# Altium project slave-12-ltc6811-1.PrjPcb (part 2 of 2)

## Sheet secon_analog_in.SchDoc: foxBMS BMS-Slave 12-Cell
size A3; DocumentNumber: 10; SheetNumber: 10; SheetTotal: 19; AUTHOR: Fraunhofer IISB foxBMS Team; SheetDescription: Secondary Analog Inputs
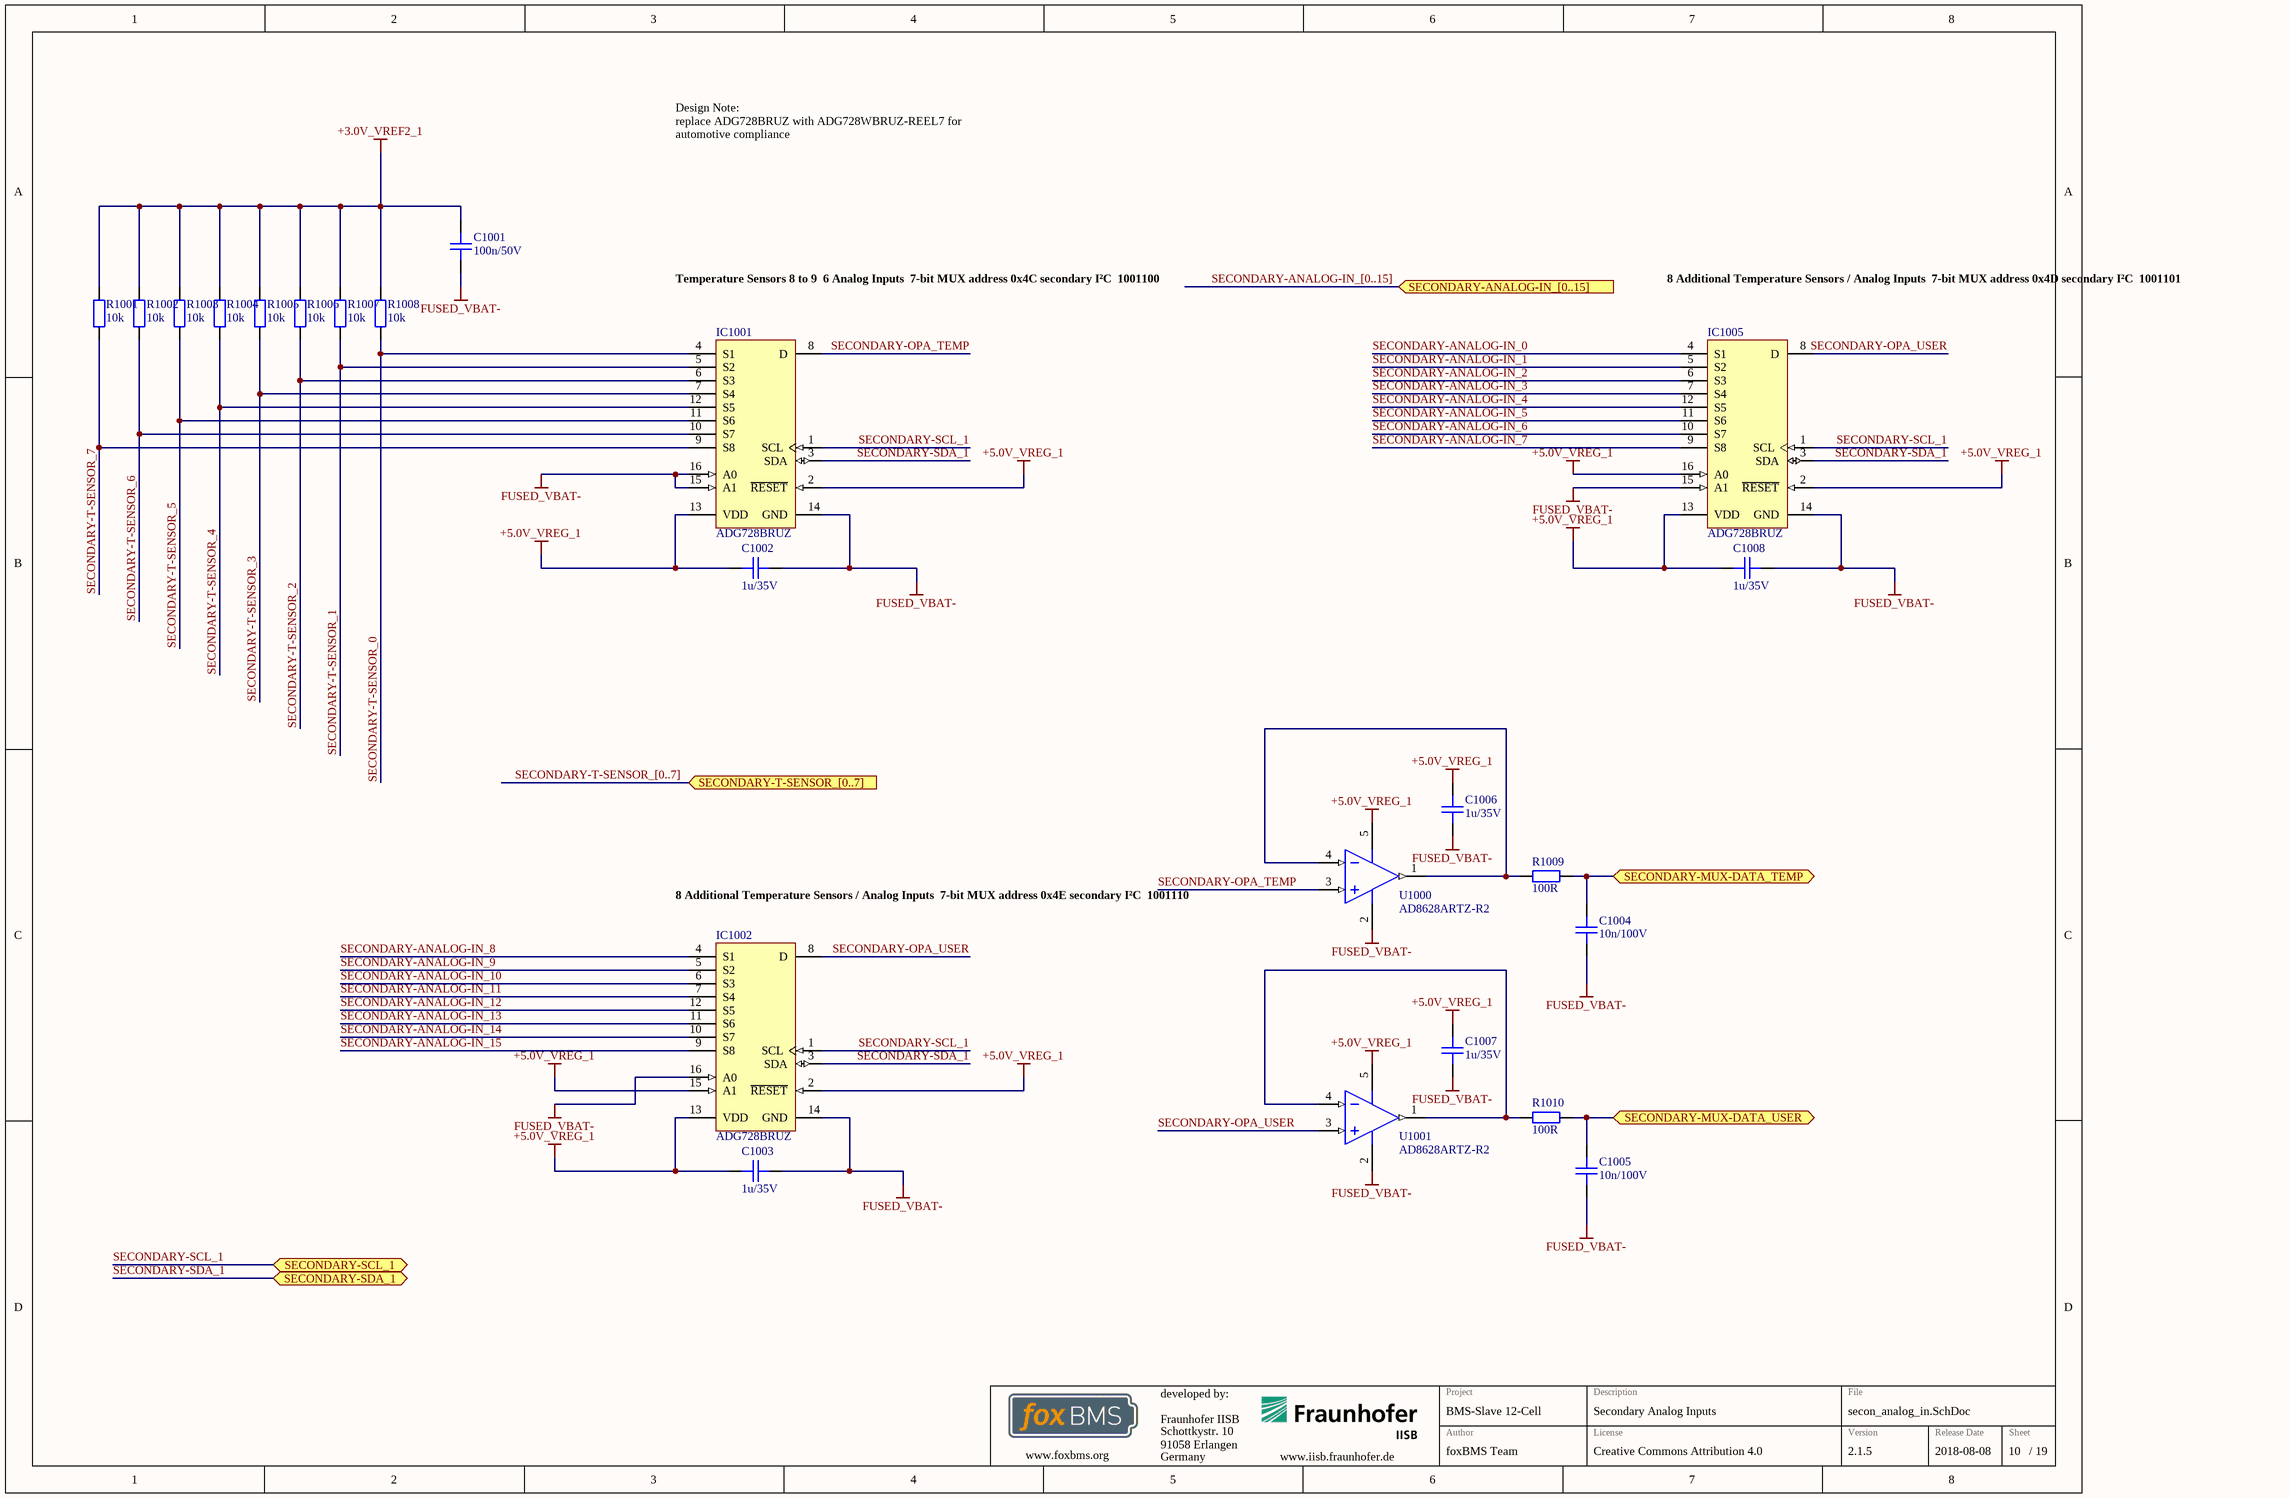
[diagram p6: secon_analog_in.SchDoc]

### Parts
C1001  100n/50V  [CAPC1608X08N]
C1002  1u/35V  [CAPC1608X08N]
C1003  1u/35V  [CAPC1608X08N]
C1004  10n/100V  [CAPC1608X08N]
C1005  10n/100V  [CAPC1608X08N]
C1006  1u/35V  [CAPC1608X08N]
C1007  1u/35V  [CAPC1608X08N]
C1008  1u/35V  [CAPC1608X08N]
IC1001  ADG728BRUZ  [ADI-RU-16_M]
IC1002  ADG728BRUZ  [ADI-RU-16_M]
IC1005  ADG728BRUZ  [ADI-RU-16_M]
R1001  10k  [RESC1608X05N]
R1002  10k  [RESC1608X05N]
R1003  10k  [RESC1608X05N]
R1004  10k  [RESC1608X05N]
R1005  10k  [RESC1608X05N]
R1006  10k  [RESC1608X05N]
R1007  10k  [RESC1608X05N]
R1008  10k  [RESC1608X05N]
R1009  100R  [RESC1608X05N]
R1010  100R  [RESC1608X05N]
U1000  AD8628ARTZ-R2  [ADI-RJ-5_M]
U1001  AD8628ARTZ-R2  [ADI-RJ-5_M]

### Ports
SECONDARY-ANALOG-IN_[0..15] (in), SECONDARY-MUX-DATA_TEMP (bidir), SECONDARY-MUX-DATA_USER (bidir), SECONDARY-SCL_1 (bidir), SECONDARY-SDA_1 (bidir), SECONDARY-T-SENSOR_[0..7] (in)

### Nets
+3.0V_VREF2_1: C1001.2 R1001.2 R1002.2 R1003.2 R1004.2 R1005.2 R1006.2 R1007.2 R1008.2
+5.0V_VREG_1: C1002.2 C1003.2 C1006.2 C1007.2 C1008.2 IC1001.2(~{RESET}) IC1001.13(VDD) IC1002.2(~{RESET}) IC1002.13(VDD) IC1002.15(A1) IC1005.2(~{RESET}) IC1005.13(VDD) IC1005.16(A0) U1000.5(+V) U1001.5(+V)
FUSED_VBAT-: C1001.1 C1002.1 C1003.1 C1004.1 C1005.1 C1006.1 C1007.1 C1008.1 IC1001.14(GND) IC1001.15(A1) IC1001.16(A0) IC1002.14(GND) IC1002.16(A0) IC1005.14(GND) IC1005.15(A1) U1000.2(-V) U1001.2(-V)
SECONDARY-ANALOG-IN_0: IC1005.4(S1)
SECONDARY-ANALOG-IN_1: IC1005.5(S2)
SECONDARY-ANALOG-IN_2: IC1005.6(S3)
SECONDARY-ANALOG-IN_3: IC1005.7(S4)
SECONDARY-ANALOG-IN_4: IC1005.12(S5)
SECONDARY-ANALOG-IN_5: IC1005.11(S6)
SECONDARY-ANALOG-IN_6: IC1005.10(S7)
SECONDARY-ANALOG-IN_7: IC1005.9(S8)
SECONDARY-ANALOG-IN_8: IC1002.4(S1)
SECONDARY-ANALOG-IN_9: IC1002.5(S2)
SECONDARY-ANALOG-IN_10: IC1002.6(S3)
SECONDARY-ANALOG-IN_11: IC1002.7(S4)
SECONDARY-ANALOG-IN_12: IC1002.12(S5)
SECONDARY-ANALOG-IN_13: IC1002.11(S6)
SECONDARY-ANALOG-IN_14: IC1002.10(S7)
SECONDARY-ANALOG-IN_15: IC1002.9(S8)
SECONDARY-OPA_TEMP: IC1001.8(D) U1000.3(+IN)
SECONDARY-OPA_USER: IC1002.8(D) IC1005.8(D) U1001.3(+IN)
SECONDARY-SCL_1: IC1001.1(SCL) IC1002.1(SCL) IC1005.1(SCL) ; port SECONDARY-SCL_1
SECONDARY-SDA_1: IC1001.3(SDA) IC1002.3(SDA) IC1005.3(SDA) ; port SECONDARY-SDA_1
SECONDARY-T-SENSOR_0: IC1001.4(S1) R1008.1
SECONDARY-T-SENSOR_1: IC1001.5(S2) R1007.1
SECONDARY-T-SENSOR_2: IC1001.6(S3) R1006.1
SECONDARY-T-SENSOR_3: IC1001.7(S4) R1005.1
SECONDARY-T-SENSOR_4: IC1001.12(S5) R1004.1
SECONDARY-T-SENSOR_5: IC1001.11(S6) R1003.1
SECONDARY-T-SENSOR_6: IC1001.10(S7) R1002.1
SECONDARY-T-SENSOR_7: IC1001.9(S8) R1001.1
NetC1004_2: C1004.2 R1009.2 ; port SECONDARY-MUX-DATA_TEMP
NetC1005_2: C1005.2 R1010.2 ; port SECONDARY-MUX-DATA_USER
NetR1009_1: R1009.1 U1000.1(OUT) U1000.4(-IN)
NetR1010_1: R1010.1 U1001.1(OUT) U1001.4(-IN)

### Buses and harness runs
bus SECONDARY-ANALOG-IN_[0..15] = port SECONDARY-ANALOG-IN_[0..15]
bus SECONDARY-T-SENSOR_[0..7] = port SECONDARY-T-SENSOR_[0..7]

### Notes on the sheet
- Design Note:
  replace ADG728BRUZ with ADG728WBRUZ-REEL7 for automotive compliance
- Temperature Sensors 8 to 9
  6 Analog Inputs
  7-bit MUX address 0x4C secondary I²C
  1001100
- 8 Additional Temperature Sensors / Analog Inputs
  7-bit MUX address 0x4D secondary I²C
  1001101
- 8 Additional Temperature Sensors / Analog Inputs
  7-bit MUX address 0x4E secondary I²C
  1001110
- Fraunhofer IISB
- Schottkystr. 10
- developed by:
- 91058 Erlangen
- Germany
- Author
- Project
- License
- Description
- File
- Version
- Release Date
- Sheet
- www.foxbms.org
- www.iisb.fraunhofer.de
- foxBMS Team
- /

### Library data of the parts
C1001 = gen_C_ceramic_100n_50V_X7R_0603: MLCC; Capacitance: 100n; Rated Voltage: 50V; Dielectric: X7R; Case EIA: 0603; Case Metric: 1608; PnP Package: C_0603_10; PnP Value: 100n/50V/X7R; PnP equipped: x; Automotive Qualified: False; Part Number: gen_C_ceramic_100n_50V_X7R_0603; Supplier 1: Farnell; Supplier Part Number 1: 2525267; Supplier 2: Digikey; Supplier Part Number 2: 490-6049-1-ND
C1002 C1003 C1006-C1008 = gen_C_ceramic_1u_35V_X7R_0603: MLCC; Capacitance: 1u; Rated Voltage: 35V; Dielectric: X7R; Case EIA: 0603; Case Metric: 1608; PnP Package: C_0603_10; PnP Value: 1uF/35V/X7R; PnP equipped: x; Automotive Qualified: False; Part Number: gen_C_ceramic_1u_35V_X7R_0603; Supplier 1: Farnell; Supplier Part Number 1: 1907508
C1004 C1005 = gen_C_ceramic_10n_100V_X7R_0603: MLCC; Capacitance: 10n; Rated Voltage: 100V; Dielectric: X7R; Case EIA: 0603; Case Metric: 1608; Automotive Qualified: False; Part Number: gen_C_ceramic_10n_100V_X7R_0603; Supplier 1: Farnell; Supplier Part Number 1: 1865545
IC1001 IC1002 IC1005 = CMP-0798-00197-1: CMOS, Low Voltage, 2-Wire Serially Controlled, Matrix Switch, -40 to 85 degC, 16-pin SOP (RU-16), Tube; Manufacturer: Analog Devices; Ron (ohms): 2.5; Supply V Guar Performance: Single_(+3V), Single_(+5V); Max Analog Signal Range: 0 to Vdd; Bandwidth (Hz): 65M; ComponentLink3Description: Package Specification; Packing: Tube; PartNumber: ADG728BRUZ; ComponentLink1URL: http://www.analog.com/en/index.html; Mounting Technology: Surface Mount; DatasheetVersion: Rev. C; ComponentLink1Description: Manufacturer URL; ComponentLink3URL: http:/www.analog.com/static/imported-files/packages/36244347913743854010197452789RU16.pdf; ComponentLink2URL: http://www.analog.com/static/imported-files/data_sheets/ADG728_729.pdf; PackageVersion: Nov-02; PackageDescription: 16-Pin Thin Shrink Small Outline Package, Body 5 x 4.4 mm, Pitch 0.65 mm; Code_JEDEC: MO-153AB; PackageReference: RU-16; ComponentLink2Description: Datasheet
R1001-R1008 = gen_R_10k_0603: SMD Resistor 10k 0603; Tolerance: 1%; Power: 0.1W; Case EIA: 0603; Case Metric: 1608; Maximum Working Voltage: 75V; PnP Package: R_0603; Automotive Qualified: False; Part Number: gen_R_10k_0603; Operating Temperature: -55°C - +155°C; Resistance: 10k; Series: E24, E96; PnP Value: 10k; Supplier 1: Farnell; Supplier Part Number 1: 2073349
R1009 R1010 = gen_R_100R_0603: SMD Resistor 100R 0603; Tolerance: 1%; Power: 0.1W; Case EIA: 0603; Case Metric: 1608; Maximum Working Voltage: 75V; PnP Package: R_0603; Automotive Qualified: False; Part Number: gen_R_100R_0603; Operating Temperature: -55°C - +155°C; Resistance: 100R; Series: E24, E96; PnP Value: 100R; Supplier 1: Farnell; Supplier Part Number 1: 1469752
U1000 U1001 = CMP-0384-01512-2: Single Channel RRIO Operational Amplifier, 2.5 MHz BW, 1 V/us SR, Industrial, 5-pin SOT23 (RJ-5), Reel; Manufacturer: Analog Devices; Generic Part Number: AD8628; Iq/Amp: 1.1mA; Automotive Qualified: Yes; V Span Max: 6V; Input Bias Current: 30pA; Slew Rate: 1V/us; Amplifiers Per Package: 1; Input Offset Voltage: 1uV; Small Signal Bandwidth: 2.5MHz; V Span Min: 2.7V; ComponentLink1Description: Manufacturer URL; DatasheetVersion: Rev. I; ComponentLink4Description: Reference Circuit; Code_JEDEC: MO-178-AA; PackageDescription: 5-Pin Small Outline Transistor Package, Body 2.9 x 1.6 mm, Pitch 0.95 mm; ComponentLink3URL: http://www.analog.com/static/imported-files/packages/PKG_PDF/SOT-23(RJ)/RJ_5.pdf; PackageReference: RJ-5; ComponentLink1URL: http://www.analog.com/en/index.html; PackageVersion: 121608-A; RevisionNote: Reference Circuit URL fixed; Mounting Technology: Surface Mount; ComponentLink2Description: Datasheet; ComponentLink3Description: Package Specification; ComponentLink4URL: http://www.analog.com/en/all-operational-amplifiers-op-amps/operational-amplifiers-op-amps/ad8628/products/product.html#product-recommendations; ComponentLink2URL: http://www.analog.com/static/imported-files/data_sheets/AD8628_8629_8630.pdf; PartNumber: AD8628ARTZ-R2

## Sheet secondary_DIO.SchDoc: foxBMS BMS-Slave 12-Cell
size A3; DocumentNumber: 12; SheetNumber: 12; SheetTotal: 19; AUTHOR: Fraunhofer IISB foxBMS Team; SheetDescription: Secondary Digital Inputs/Outputs
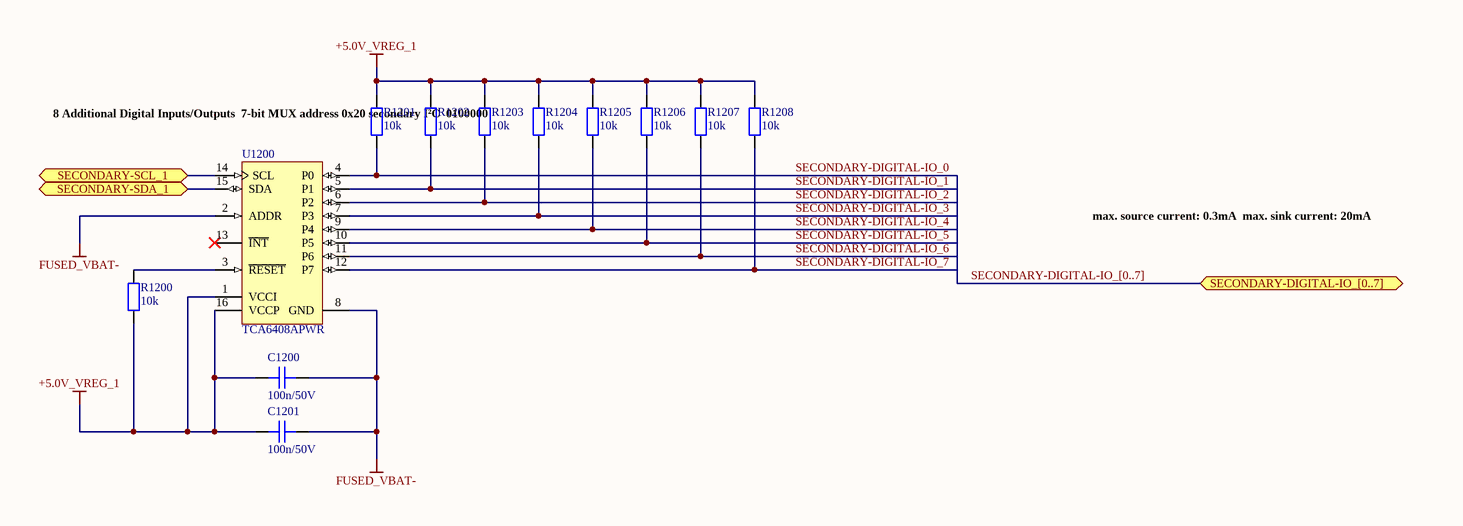
[diagram p7: secondary_DIO.SchDoc]

### Parts
C1200  100n/50V  [CAPC1608X08N]
C1201  100n/50V  [CAPC1608X08N]
R1200  10k  [RESC1608X05N]
R1201  10k  [RESC1608X05N]
R1202  10k  [RESC1608X05N]
R1203  10k  [RESC1608X05N]
R1204  10k  [RESC1608X05N]
R1205  10k  [RESC1608X05N]
R1206  10k  [RESC1608X05N]
R1207  10k  [RESC1608X05N]
R1208  10k  [RESC1608X05N]
U1200  TCA6408APWR  [PW0016A_L]

### Ports
SECONDARY-DIGITAL-IO_[0..7] (bidir), SECONDARY-SCL_1 (bidir), SECONDARY-SDA_1 (bidir)

### Nets
+5.0V_VREG_1: C1200.2 C1201.2 R1200.1 R1201.2 R1202.2 R1203.2 R1204.2 R1205.2 R1206.2 R1207.2 R1208.2 U1200.1(VCCI) U1200.16(VCCP)
FUSED_VBAT-: C1200.1 C1201.1 U1200.2(ADDR) U1200.8(GND)
SECONDARY-DIGITAL-IO_0: R1201.1 U1200.4(P0)
SECONDARY-DIGITAL-IO_1: R1202.1 U1200.5(P1)
SECONDARY-DIGITAL-IO_2: R1203.1 U1200.6(P2)
SECONDARY-DIGITAL-IO_3: R1204.1 U1200.7(P3)
SECONDARY-DIGITAL-IO_4: R1205.1 U1200.9(P4)
SECONDARY-DIGITAL-IO_5: R1206.1 U1200.10(P5)
SECONDARY-DIGITAL-IO_6: R1207.1 U1200.11(P6)
SECONDARY-DIGITAL-IO_7: R1208.1 U1200.12(P7)
NetR1200_2: R1200.2 U1200.3(~{RESET})
NetU1200_14: U1200.14(SCL) ; port SECONDARY-SCL_1
NetU1200_15: U1200.15(SDA) ; port SECONDARY-SDA_1

Not connected (* = marked no-connect by the designer): U1200 13(~{INT})*

### Buses and harness runs
bus SECONDARY-DIGITAL-IO_[0..7] = port SECONDARY-DIGITAL-IO_[0..7]

### Notes on the sheet
- 8 Additional Digital Inputs/Outputs
  7-bit MUX address 0x20 secondary I²C
  0100000
- max. source current: 0.3mA
  max. sink current: 20mA
- Fraunhofer IISB
- Schottkystr. 10
- developed by:
- 91058 Erlangen
- Germany
- Author
- Project
- License
- Description
- File
- Version
- Release Date
- Sheet
- www.foxbms.org
- www.iisb.fraunhofer.de
- foxBMS Team
- /

### Library data of the parts
C1200 C1201 = gen_C_ceramic_100n_50V_X7R_0603: MLCC; Capacitance: 100n; Rated Voltage: 50V; Dielectric: X7R; Case EIA: 0603; Case Metric: 1608; PnP Package: C_0603_10; PnP Value: 100n/50V/X7R; PnP equipped: x; Automotive Qualified: True; Part Number: gen_C_ceramic_100n_50V_X7R_0603; Supplier 1: Farnell; Supplier Part Number 1: 2525267; Supplier 2: Digikey; Supplier Part Number 2: 490-6049-1-ND; Supplier 3: Farnell; Supplier Part Number 3: 2070398
R1200 = gen_R_10k_0603: SMD Resistor 10k 0603; Tolerance: 1%; Power: 0.1W; Case EIA: 0603; Case Metric: 1608; Maximum Working Voltage: 75V; PnP Package: R_0603; Automotive Qualified: True; Part Number: gen_R_10k_0603; Operating Temperature: -55°C - +155°C; Resistance: 10k; Series: E24, E96; PnP Value: 10k; Supplier 1: Farnell; Supplier Part Number 1: 2073349
R1201-R1208 = gen_R_10k_0603: as R1001 on sheet secon_analog_in; Part Number: gen_R_10k_0603; Operating Temperature: -55°C - +155°C; Resistance: 10k; Series: E24, E96; PnP Value: 10k; Supplier 1: Farnell; Supplier Part Number 1: 2073349
U1200 = CMP-0314-00338-2: Low-Voltage 8-Bit I2C and SMBus I/O Expander, 1.65 to 5.5 V, -40 to 85 degC, 16-pin TSSOP (PW), Green (RoHS & no Sb/Br); Manufacturer: Texas Instruments; Push-Pull I/O Type: Yes; Max Frequency(kHz): 400; No. of Outputs: 8; VCC(Min)(V): 1.65; SubFamily: I2C IO Expander; I2C Address: 0100 00x; VCC(Max)(V): 5.5; Vcc range(V): 1.65 to 5.5; PackageDescription: 16-Pin Plastic Thin Small Outline Package 5 x 4.4 mm Body ,0.65 mm Pitch; PartNumber: TCA6408APWR; Configuration Registers: Yes; Eco-Plan: Green (RoHS & no Sb/Br); ComponentLink1Description: Datasheet; Low Power: Yes; ComponentLink1URL: http://www.ti.com/general/docs/lit/getliterature.tsp?genericPartNumber=TCA6408A&fileType=pdf; 5V Tolerant I/O: Yes; Code_JEDEC: MO-153; Interrupt Output: Yes; PackageVersion: revG, Feb-2011; # of I/Os: 8; Reset Input: Yes; fSCLK(Max)(MHz): 400; PackageReference: PW0016A; Mounting Technology: Surface Mount; DatasheetVersion: SCPS192C

## Sheet secondary_EEPROM_and_T.SchDoc: foxBMS BMS-Slave 12-Cell
size A3; DocumentNumber: 14; SheetNumber: 14; SheetTotal: 19; AUTHOR: Fraunhofer IISB foxBMS Team; SheetDescription: Secondary EEPROM and Board T-Sensor
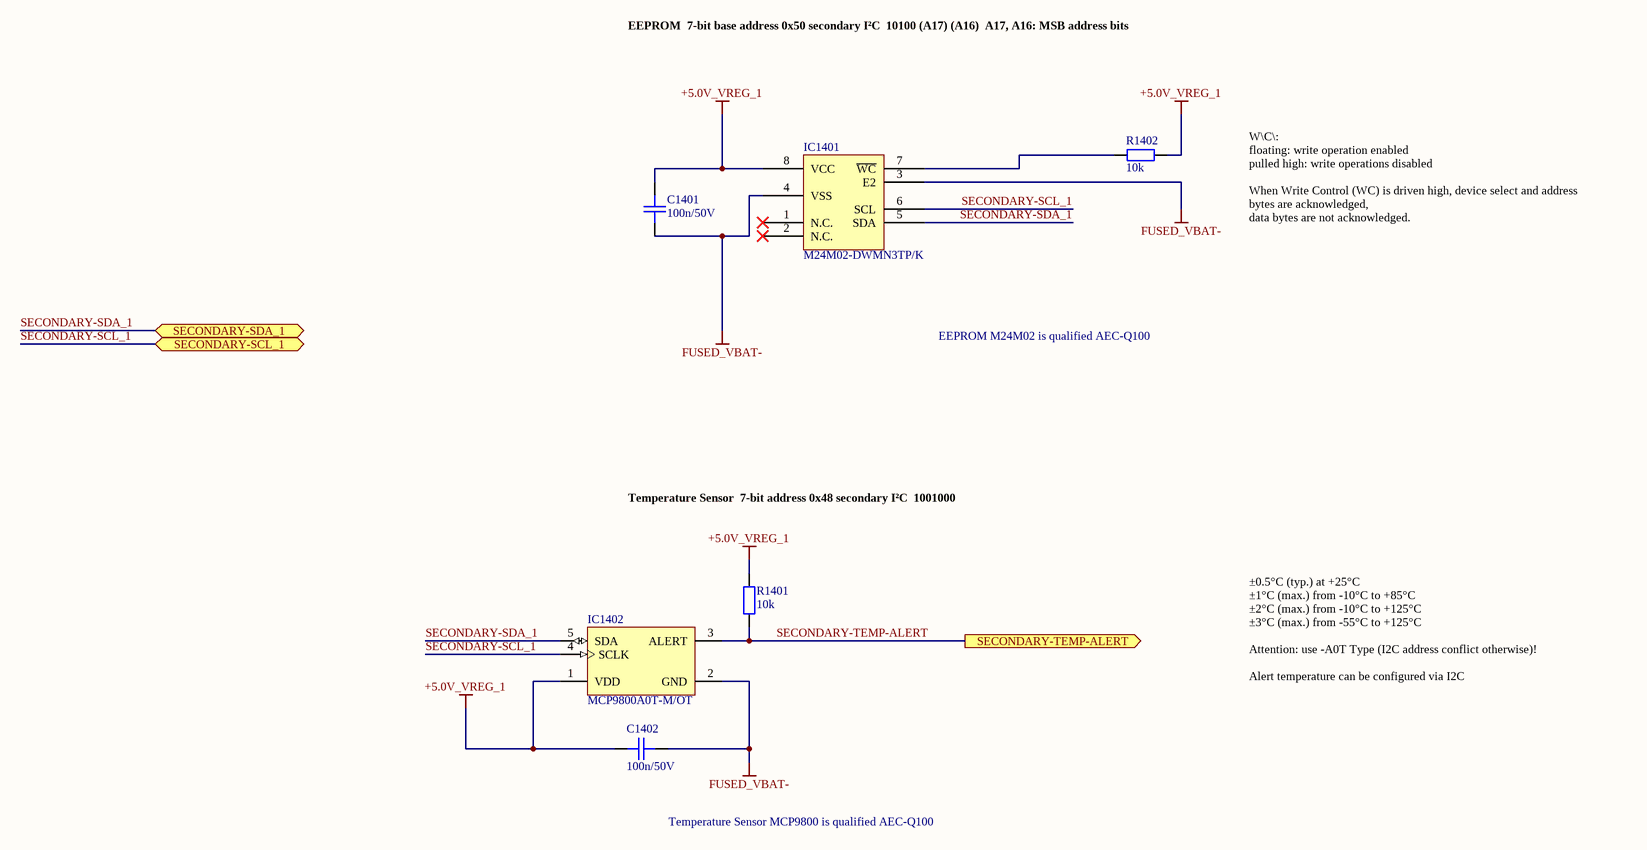
[diagram p8: secondary_EEPROM_and_T.SchDoc]

### Parts
C1401  100n/50V  [CAPC1608X08N]
C1402  100n/50V  [CAPC1608X08N]
IC1401  M24M02-DWMN3TP/K  [SOIC127P600X175-8N]
IC1402  MCP9800A0T-M/OT  [SOT-23-OT5_L]
R1401  10k  [RESC1608X05N]
R1402  10k  [RESC1608X05N]

### Ports
SECONDARY-SCL_1 (bidir), SECONDARY-SDA_1 (bidir), SECONDARY-TEMP-ALERT (out)

### Nets
+5.0V_VREG_1: C1401.2 C1402.2 IC1401.8(VCC) IC1402.1(VDD) R1401.2 R1402.2
FUSED_VBAT-: C1401.1 C1402.1 IC1401.3(E2) IC1401.4(VSS) IC1402.2(GND)
SECONDARY-SCL_1: IC1401.6(SCL) IC1402.4(SCLK) ; port SECONDARY-SCL_1
SECONDARY-SDA_1: IC1401.5(SDA) IC1402.5(SDA) ; port SECONDARY-SDA_1
SECONDARY-TEMP-ALERT: IC1402.3(ALERT) R1401.1 ; port SECONDARY-TEMP-ALERT
NetIC1401_7: IC1401.7(~{WC}) R1402.1

Not connected (* = marked no-connect by the designer): IC1401 1(N.C.)* 2(N.C.)*

### Notes on the sheet
- EEPROM
  7-bit base address 0x50 secondary I²C
  10100 (A17) (A16)
  A17, A16: MSB address bits
- W\C\:
  floating: write operation enabled
  pulled high: write operations disabled
  When Write Control (WC) is driven high, device select and address bytes are acknowledged,
  data bytes are not acknowledged.
- EEPROM M24M02 is qualified AEC-Q100
- Temperature Sensor
  7-bit address 0x48 secondary I²C
  1001000
- ±0.5°C (typ.) at +25°C
  ±1°C (max.) from -10°C to +85°C
  ±2°C (max.) from -10°C to +125°C
  ±3°C (max.) from -55°C to +125°C
  Attention: use -A0T Type (I2C address conflict otherwise)!
  Alert temperature can be configured via I2C
- Temperature Sensor MCP9800 is qualified AEC-Q100
- Fraunhofer IISB
- Schottkystr. 10
- developed by:
- 91058 Erlangen
- Germany
- Author
- Project
- License
- Description
- File
- Version
- Release Date
- Sheet
- www.foxbms.org
- www.iisb.fraunhofer.de
- foxBMS Team
- /

### Library data of the parts
C1401 C1402 = gen_C_ceramic_100n_50V_X7R_0603: as C1001 on sheet secon_analog_in; Part Number: gen_C_ceramic_100n_50V_X7R_0603; Supplier 1: Farnell; Supplier Part Number 1: 2525267; Supplier 2: Digikey; Supplier Part Number 2: 490-6049-1-ND
IC1401 = M24M02-DWMN3TP/K: Automotive 2-Mbit serial I²C / bus EEPROM with 1 MHz clock; Manufacturer: STMicroelectronics; PnP Package: SO8N; Automotive Qualified: True; Part Number: M24M02-DWMN3TP/K; Part Name: M24M02-DWMN3TP/K; Operating Temperature: -40°C - +125°C; ComponentLink1Description: Datasheet; ComponentLink1URL: http://www.st.com/content/ccc/resource/technical/document/datasheet/83/f4/3e/e4/4e/49/42/c5/DM00200595.pdf/files/DM00200595.pdf/jcr:content/translations/en.DM00200595.pdf; Supplier 1: Digikey; Supplier Part Number 1: 497-16238-1-ND; Supplier 2: Mouser; Supplier Part Number 2: 511-M24M02-DWMN3TP/K
IC1402 = CMP-0192-00211-1: 2-Wire High-Accuracy Temperature Sensor, Slave Address 000, 5-Pin SOT-23, -55°C to +125°C Temperature, Tape and Reel; PackageReference: SOT-23-OT5; PackageVersion: revBB, Aug-2009; DatasheetVersion: revD, Nov-2010; PackageDescription: 5-Lead Plastic Small Outline Transistor (OT) [SOT-23]; Code_IPC: SOT23-5
R1401 R1402 = gen_R_10k_0603: as R1001 on sheet secon_analog_in; Part Number: gen_R_10k_0603; Operating Temperature: -55°C - +155°C; Resistance: 10k; Series: E24, E96; PnP Value: 10k; Supplier 1: Farnell; Supplier Part Number 1: 2073349

## Sheet connectors.SchDoc: foxBMS BMS-Slave 12-Cell
size A3; DocumentNumber: 16; SheetNumber: 16; SheetTotal: 19; AUTHOR: Fraunhofer IISB foxBMS Team; SheetDescription: Connectors
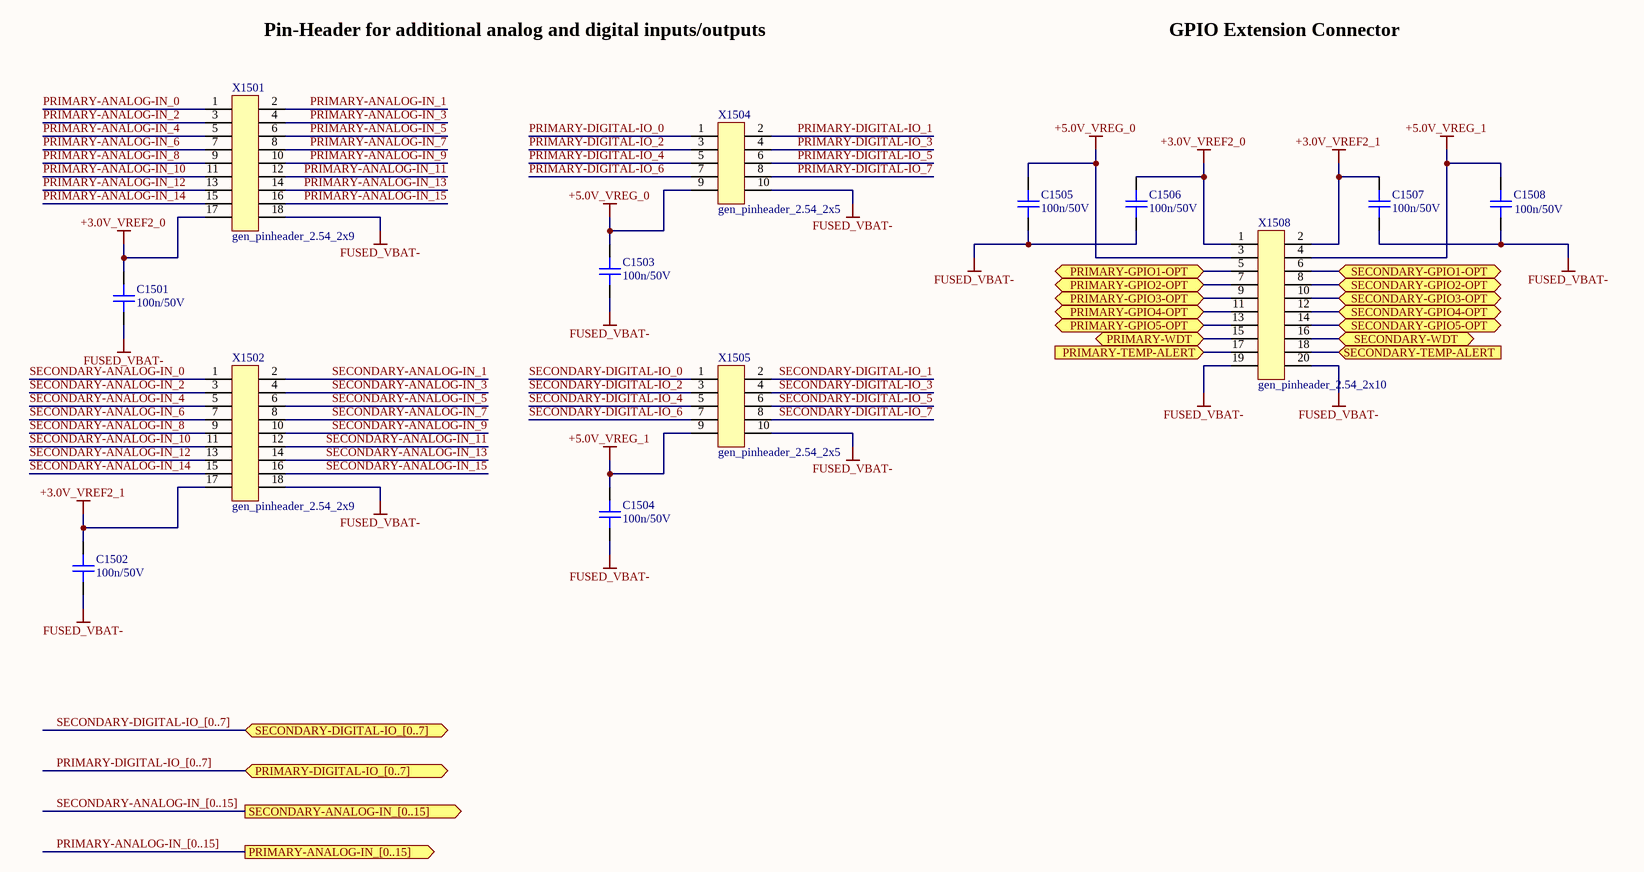
[diagram p9: connectors.SchDoc]

### Parts
C1501  100n/50V  [CAPC1608X08N]
C1502  100n/50V  [CAPC1608X08N]
C1503  100n/50V  [CAPC1608X08N]
C1504  100n/50V  [CAPC1608X08N]
C1505  100n/50V  [CAPC1608X08N]
C1506  100n/50V  [CAPC1608X08N]
C1507  100n/50V  [CAPC1608X08N]
C1508  100n/50V  [CAPC1608X08N]
X1501  gen_pinheader_2.54_2x9  [Pinheader_2.54_2x9]
X1502  gen_pinheader_2.54_2x9  [Pinheader_2.54_2x9]
X1504  gen_pinheader_2.54_2x5  [Pinheader_2.54_2x5]
X1505  gen_pinheader_2.54_2x5  [Pinheader_2.54_2x5]
X1508  gen_pinheader_2.54_2x10  [Pinheader_2.54_2x10]

### Ports
PRIMARY-ANALOG-IN_[0..15] (out), PRIMARY-DIGITAL-IO_[0..7] (bidir), PRIMARY-GPIO1-OPT (bidir), PRIMARY-GPIO2-OPT (bidir), PRIMARY-GPIO3-OPT (bidir), PRIMARY-GPIO4-OPT (bidir), PRIMARY-GPIO5-OPT (bidir), PRIMARY-TEMP-ALERT (in), PRIMARY-WDT (bidir), SECONDARY-ANALOG-IN_[0..15] (out), SECONDARY-DIGITAL-IO_[0..7] (bidir), SECONDARY-GPIO1-OPT (bidir), SECONDARY-GPIO2-OPT (bidir), SECONDARY-GPIO3-OPT (bidir), SECONDARY-GPIO4-OPT (bidir), SECONDARY-GPIO5-OPT (bidir), SECONDARY-TEMP-ALERT (in), SECONDARY-WDT (bidir)

### Nets
+3.0V_VREF2_0: C1501.2 C1506.2 X1501.17 X1508.1
+3.0V_VREF2_1: C1502.2 C1507.2 X1502.17 X1508.2
+5.0V_VREG_0: C1503.2 C1505.2 X1504.9 X1508.3
+5.0V_VREG_1: C1504.2 C1508.2 X1505.9 X1508.4
FUSED_VBAT-: C1501.1 C1502.1 C1503.1 C1504.1 C1505.1 C1506.1 C1507.1 C1508.1 X1501.18 X1502.18 X1504.10 X1505.10 X1508.19 X1508.20
PRIMARY-ANALOG-IN_0: X1501.1
PRIMARY-ANALOG-IN_1: X1501.2
PRIMARY-ANALOG-IN_2: X1501.3
PRIMARY-ANALOG-IN_3: X1501.4
PRIMARY-ANALOG-IN_4: X1501.5
PRIMARY-ANALOG-IN_5: X1501.6
PRIMARY-ANALOG-IN_6: X1501.7
PRIMARY-ANALOG-IN_7: X1501.8
PRIMARY-ANALOG-IN_8: X1501.9
PRIMARY-ANALOG-IN_9: X1501.10
PRIMARY-ANALOG-IN_10: X1501.11
PRIMARY-ANALOG-IN_11: X1501.12
PRIMARY-ANALOG-IN_12: X1501.13
PRIMARY-ANALOG-IN_13: X1501.14
PRIMARY-ANALOG-IN_14: X1501.15
PRIMARY-ANALOG-IN_15: X1501.16
PRIMARY-DIGITAL-IO_0: X1504.1
PRIMARY-DIGITAL-IO_1: X1504.2
PRIMARY-DIGITAL-IO_2: X1504.3
PRIMARY-DIGITAL-IO_3: X1504.4
PRIMARY-DIGITAL-IO_4: X1504.5
PRIMARY-DIGITAL-IO_5: X1504.6
PRIMARY-DIGITAL-IO_6: X1504.7
PRIMARY-DIGITAL-IO_7: X1504.8
SECONDARY-ANALOG-IN_0: X1502.1
SECONDARY-ANALOG-IN_1: X1502.2
SECONDARY-ANALOG-IN_2: X1502.3
SECONDARY-ANALOG-IN_3: X1502.4
SECONDARY-ANALOG-IN_4: X1502.5
SECONDARY-ANALOG-IN_5: X1502.6
SECONDARY-ANALOG-IN_6: X1502.7
SECONDARY-ANALOG-IN_7: X1502.8
SECONDARY-ANALOG-IN_8: X1502.9
SECONDARY-ANALOG-IN_9: X1502.10
SECONDARY-ANALOG-IN_10: X1502.11
SECONDARY-ANALOG-IN_11: X1502.12
SECONDARY-ANALOG-IN_12: X1502.13
SECONDARY-ANALOG-IN_13: X1502.14
SECONDARY-ANALOG-IN_14: X1502.15
SECONDARY-ANALOG-IN_15: X1502.16
SECONDARY-DIGITAL-IO_0: X1505.1
SECONDARY-DIGITAL-IO_1: X1505.2
SECONDARY-DIGITAL-IO_2: X1505.3
SECONDARY-DIGITAL-IO_3: X1505.4
SECONDARY-DIGITAL-IO_4: X1505.5
SECONDARY-DIGITAL-IO_5: X1505.6
SECONDARY-DIGITAL-IO_6: X1505.7
SECONDARY-DIGITAL-IO_7: X1505.8
NetX1508_5: X1508.5 ; port PRIMARY-GPIO1-OPT
NetX1508_6: X1508.6 ; port SECONDARY-GPIO1-OPT
NetX1508_7: X1508.7 ; port PRIMARY-GPIO2-OPT
NetX1508_8: X1508.8 ; port SECONDARY-GPIO2-OPT
NetX1508_9: X1508.9 ; port PRIMARY-GPIO3-OPT
NetX1508_10: X1508.10 ; port SECONDARY-GPIO3-OPT
NetX1508_11: X1508.11 ; port PRIMARY-GPIO4-OPT
NetX1508_12: X1508.12 ; port SECONDARY-GPIO4-OPT
NetX1508_13: X1508.13 ; port PRIMARY-GPIO5-OPT
NetX1508_14: X1508.14 ; port SECONDARY-GPIO5-OPT
NetX1508_15: X1508.15 ; port PRIMARY-WDT
NetX1508_16: X1508.16 ; port SECONDARY-WDT
NetX1508_17: X1508.17 ; port PRIMARY-TEMP-ALERT
NetX1508_18: X1508.18 ; port SECONDARY-TEMP-ALERT

### Buses and harness runs
bus PRIMARY-ANALOG-IN_[0..15] = port PRIMARY-ANALOG-IN_[0..15]
bus PRIMARY-DIGITAL-IO_[0..7] = port PRIMARY-DIGITAL-IO_[0..7]
bus SECONDARY-ANALOG-IN_[0..15] = port SECONDARY-ANALOG-IN_[0..15]
bus SECONDARY-DIGITAL-IO_[0..7] = port SECONDARY-DIGITAL-IO_[0..7]

### Notes on the sheet
- Pin-Header for additional analog and digital inputs/outputs
- GPIO Extension Connector
- Fraunhofer IISB
- Schottkystr. 10
- developed by:
- 91058 Erlangen
- Germany
- Author
- Project
- License
- Description
- File
- Version
- Release Date
- Sheet
- www.foxbms.org
- www.iisb.fraunhofer.de
- foxBMS Team
- /

### Library data of the parts
C1501-C1508 = gen_C_ceramic_100n_50V_X7R_0603: MLCC; Capacitance: 100n; Rated Voltage: 50V; Dielectric: X7R; Case EIA: 0603; Case Metric: 1608; PnP Package: C_0603_10; PnP Value: 100n/50V/X7R; PnP equipped: x; Automotive Qualified: False; Part Number: gen_C_ceramic_100n_50V_X7R_0603; Supplier 1: Farnell; Supplier Part Number 1: 2525267; Supplier 2: Digikey; Supplier Part Number 2: 490-6049-1-ND
X1501 X1502 = gen_pinheader_2.54_2x9: Standard Pinheader, THD, gerade, 2.54mm, 2-reihig; Circuits: 18; Rated Voltage: 250V; Rated Current: 3A; Automotive Qualified: False; Part Number: gen_pinheader_2.54_2x9; Part Name: PinHeader; Operating Temperature: −40 °C - +105 °C; Supplier 1: Farnell; Supplier Part Number 1: 2025256
X1504 X1505 = gen_pinheader_2.54_2x5: Standard Pinheader, THD, gerade, 2.54mm, 2-reihig; Circuits: 10; Rated Voltage: 250V; Rated Current: 3A; Automotive Qualified: False; Part Number: gen_pinheader_2.54_2x5; Part Name: PinHeader; Operating Temperature: −40 °C - +105 °C; Supplier 1: Farnell; Supplier Part Number 1: 2578720
X1508 = gen_pinheader_2.54_2x10: Standard Pinheader, THD, gerade, 2.54mm, 2-reihig; Circuits: 20; Rated Voltage: 250V; Rated Current: 3A; Automotive Qualified: False; Part Number: gen_pinheader_2.54_2x10; Part Name: PinHeader; Operating Temperature: −40 °C - +105 °C; Supplier 1: Farnell; Supplier Part Number 1: 2025257

## Sheet daisy_chain_connectors.SchDoc
size A3; DocumentNumber: 15; SheetNumber: 15; SheetTotal: 19; SheetDescription: Daisy Chain Connectors
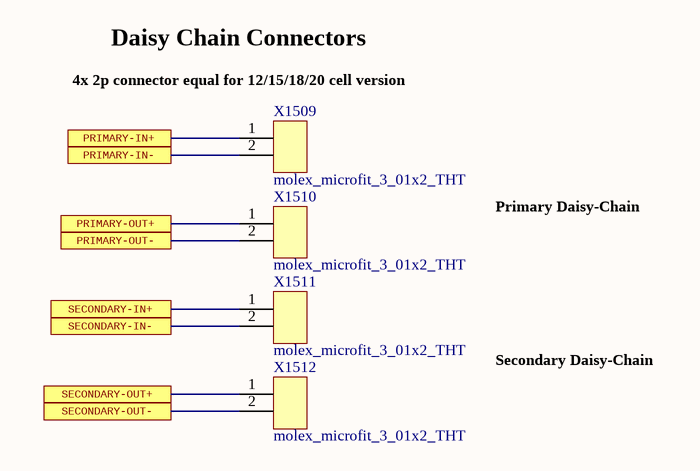
[diagram p10: daisy_chain_connectors.SchDoc]

### Parts
X1509  molex_microfit_3_01x2_THT  [MOLEX_MICROFIT_01x2_THT]
X1510  molex_microfit_3_01x2_THT  [MOLEX_MICROFIT_01x2_THT]
X1511  molex_microfit_3_01x2_THT  [MOLEX_MICROFIT_01x2_THT]
X1512  molex_microfit_3_01x2_THT  [MOLEX_MICROFIT_01x2_THT]

### Ports
PRIMARY-IN+, PRIMARY-IN-, PRIMARY-OUT+, PRIMARY-OUT-, SECONDARY-IN+, SECONDARY-IN-, SECONDARY-OUT+, SECONDARY-OUT-

### Nets
NetX1509_1: X1509.1 ; port PRIMARY-IN+
NetX1509_2: X1509.2 ; port PRIMARY-IN-
NetX1510_1: X1510.1 ; port PRIMARY-OUT+
NetX1510_2: X1510.2 ; port PRIMARY-OUT-
NetX1511_1: X1511.1 ; port SECONDARY-IN+
NetX1511_2: X1511.2 ; port SECONDARY-IN-
NetX1512_1: X1512.1 ; port SECONDARY-OUT+
NetX1512_2: X1512.2 ; port SECONDARY-OUT-

### Notes on the sheet
- Daisy Chain Connectors
- (near X1509) 4x 2p connector equal for 12/15/18/20 cell version
- Primary Daisy-Chain
- Secondary Daisy-Chain
- Fraunhofer IISB
- Schottkystr. 10
- developed by:
- 91058 Erlangen
- Germany
- Author
- Project
- License
- Description
- File
- Version
- Release Date
- Sheet
- www.foxbms.org
- www.iisb.fraunhofer.de
- foxBMS Team
- /

### Library data of the parts
X1509-X1512 = molex_microfit_3_01x2_THT: Micro-Fit 3.0 Right Angle Header, 3.00mm Pitch, Dual Row, 2 Circuits, with Snap-in Plastic Peg PCB Lock, Tin, Glow Wire Capable, Black, 43045-0200; Manufacturer: Molex; Circuits: 2; Rated Voltage: 600V; Rated Current: 8.5A; Automotive Qualified: False; Part Number: molex_microfit_3_01x2_THT; Part Name: MicroFit; Operating Temperature: -40°C - +105°C; Supplier 1: Farnell; Supplier Part Number 1: 1012251

## Sheet ext_supply_con.SchDoc
size A3; DocumentNumber: 19; SheetNumber: 19; SheetTotal: 19; SheetDescription: External Power Supply Connector
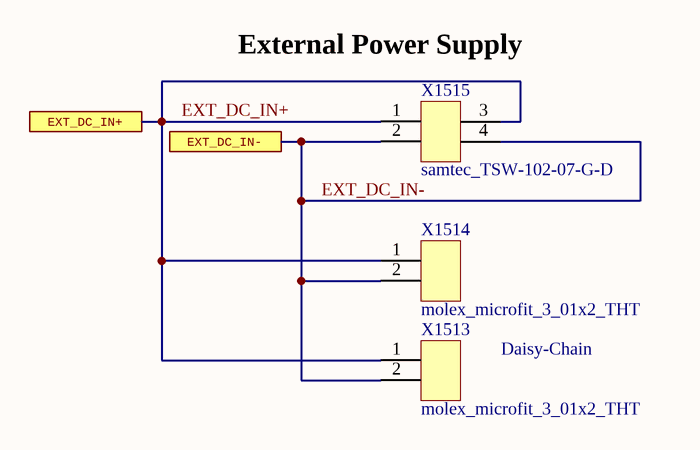
[diagram p11: ext_supply_con.SchDoc]

### Parts
X1513  molex_microfit_3_01x2_THT  [MOLEX_MICROFIT_01x2_THT]
X1514  molex_microfit_3_01x2_THT  [MOLEX_MICROFIT_01x2_THT]
X1515  samtec_TSW-102-07-G-D  [Pinheader_2.54_2x2]

### Ports
EXT_DC_IN+, EXT_DC_IN-

### Nets
EXT_DC_IN+: X1513.1 X1514.1 X1515.1 X1515.3 ; port EXT_DC_IN+
EXT_DC_IN-: X1513.2 X1514.2 X1515.2 X1515.4 ; port EXT_DC_IN-

### Notes on the sheet
- (near X1515) External Power Supply
- Daisy-Chain
- Fraunhofer IISB
- Schottkystr. 10
- developed by:
- 91058 Erlangen
- Germany
- Author
- Project
- License
- Description
- File
- Version
- Release Date
- Sheet
- www.foxbms.org
- www.iisb.fraunhofer.de
- foxBMS Team
- /

### Library data of the parts
X1513 X1514 = molex_microfit_3_01x2_THT: as X1509 on sheet daisy_chain_connectors; Part Number: molex_microfit_3_01x2_THT; Part Name: MicroFit; Operating Temperature: -40°C - +105°C; Supplier 1: Farnell; Supplier Part Number 1: 1012251
X1515 = samtec_TSW-102-07-G-D: Board-To-Board Connector, Vertical, 2.54 mm, 4 Contacts, Header, TSW Series, Through Hole, 2 Rows; Manufacturer: Samtec; Circuits: 4; Rated Voltage: 500V AC mated with SSW; Automotive Qualified: False; Part Number: samtec_TSW-102-07-G-D; Part Name: TSW-102-07-G-D; Operating Temperature: -55°C - +125°C; ComponentLink1Description: Datasheet; ComponentLink1URL: http://www.farnell.com/datasheets/1992055.pdf; Supplier 1: Farnell; Supplier Part Number 1: 2025248

## Sheet bat_connectors.SchDoc
size A3; DocumentNumber: 17; SheetNumber: 17; SheetTotal: 19; SheetDescription: Connection to pack
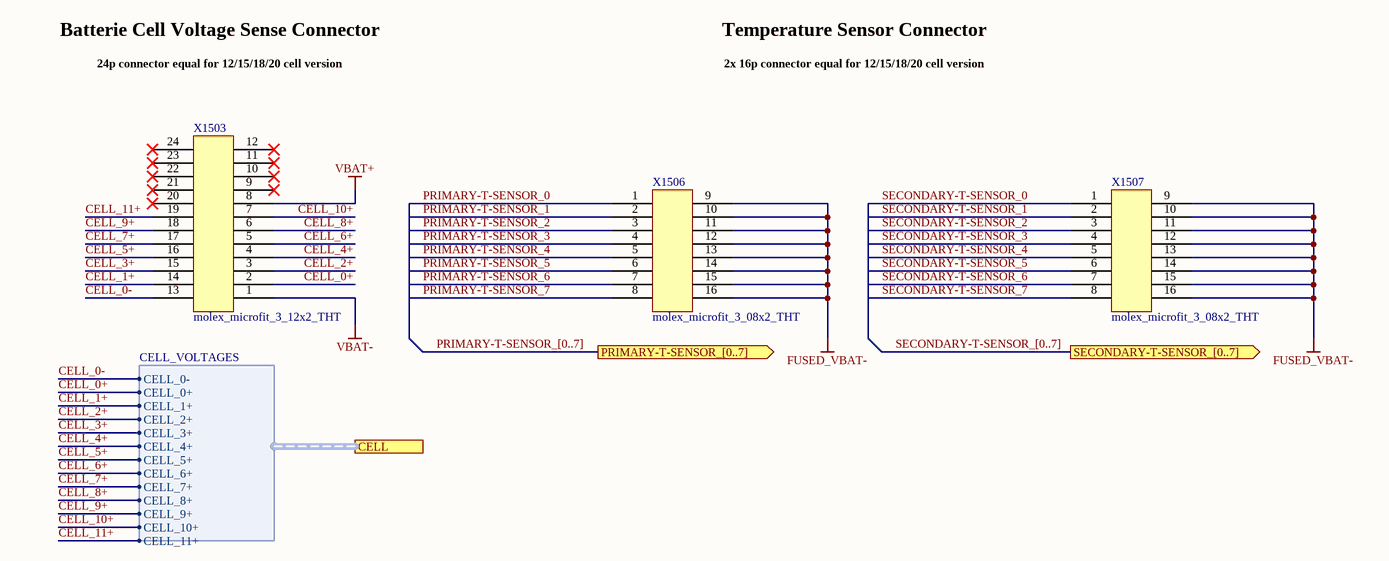
[diagram p12: bat_connectors.SchDoc]

### Parts
X1503  molex_microfit_3_12x2_THT  [MOLEX_MICROFIT_12x2_THT]
X1506  molex_microfit_3_08x2_THT  [MOLEX_MICROFIT_08x2_THT]
X1507  molex_microfit_3_08x2_THT  [MOLEX_MICROFIT_08x2_THT]

### Ports
CELL (harness CELL_VOLTAGES), PRIMARY-T-SENSOR_[0..7] (out), SECONDARY-T-SENSOR_[0..7] (out)

### Harnesses
CELL_VOLTAGES: CELL_0-, CELL_0+, CELL_1+, CELL_2+, CELL_3+, CELL_4+, CELL_5+, CELL_6+, CELL_7+, CELL_8+, CELL_9+, CELL_10+, CELL_11+

### Nets
FUSED_VBAT-: X1506.9 X1506.10 X1506.11 X1506.12 X1506.13 X1506.14 X1506.15 X1506.16 X1507.9 X1507.10 X1507.11 X1507.12 X1507.13 X1507.14 X1507.15 X1507.16
VBAT+: X1503.8
VBAT-: X1503.1
CELL_0+: X1503.2 ; port CELL.CELL_0+
CELL_0-: X1503.13 ; port CELL.CELL_0-
CELL_1+: X1503.14 ; port CELL.CELL_1+
CELL_2+: X1503.3 ; port CELL.CELL_2+
CELL_3+: X1503.15 ; port CELL.CELL_3+
CELL_4+: X1503.4 ; port CELL.CELL_4+
CELL_5+: X1503.16 ; port CELL.CELL_5+
CELL_6+: X1503.5 ; port CELL.CELL_6+
CELL_7+: X1503.17 ; port CELL.CELL_7+
CELL_8+: X1503.6 ; port CELL.CELL_8+
CELL_9+: X1503.18 ; port CELL.CELL_9+
CELL_10+: X1503.7 ; port CELL.CELL_10+
CELL_11+: X1503.19 ; port CELL.CELL_11+
PRIMARY-T-SENSOR_0: X1506.1
PRIMARY-T-SENSOR_1: X1506.2
PRIMARY-T-SENSOR_2: X1506.3
PRIMARY-T-SENSOR_3: X1506.4
PRIMARY-T-SENSOR_4: X1506.5
PRIMARY-T-SENSOR_5: X1506.6
PRIMARY-T-SENSOR_6: X1506.7
PRIMARY-T-SENSOR_7: X1506.8
SECONDARY-T-SENSOR_0: X1507.1
SECONDARY-T-SENSOR_1: X1507.2
SECONDARY-T-SENSOR_2: X1507.3
SECONDARY-T-SENSOR_3: X1507.4
SECONDARY-T-SENSOR_4: X1507.5
SECONDARY-T-SENSOR_5: X1507.6
SECONDARY-T-SENSOR_6: X1507.7
SECONDARY-T-SENSOR_7: X1507.8

Not connected (* = marked no-connect by the designer): X1503 9* 10* 11* 12* 20* 21* 22* 23* 24*

### Buses and harness runs
bus PRIMARY-T-SENSOR_[0..7] = port PRIMARY-T-SENSOR_[0..7]
bus SECONDARY-T-SENSOR_[0..7] = port SECONDARY-T-SENSOR_[0..7]

### Notes on the sheet
- Batterie Cell Voltage Sense Connector
- 24p connector equal for 12/15/18/20 cell version
- Temperature Sensor Connector
- 2x 16p connector equal for 12/15/18/20 cell version
- Fraunhofer IISB
- Schottkystr. 10
- developed by:
- 91058 Erlangen
- Germany
- Author
- Project
- License
- Description
- File
- Version
- Release Date
- Sheet
- www.foxbms.org
- www.iisb.fraunhofer.de
- foxBMS Team
- /

### Library data of the parts
X1503 = molex_microfit_3_12x2_THT: Micro-Fit 3.0 Right Angle Header, 3.00mm Pitch, Dual Row, 24 Circuits, with Snap-in Plastic Peg PCB Lock, Tin, Glow Wire Capable, Black, 43045-2400; Manufacturer: Molex; Circuits: 24; Rated Voltage: 600V; Rated Current: 8.5A; Automotive Qualified: False; Part Number: molex_microfit_3_12x2_THT; Part Name: MicroFit; Operating Temperature: -40°C - +105°C; Supplier 1: Farnell; Supplier Part Number 1: 1012245
X1506 X1507 = molex_microfit_3_08x2_THT: Micro-Fit 3.0 Right Angle Header, 3.00mm Pitch, Dual Row, 16 Circuits, with Snap-in Plastic Peg PCB Lock, Tin, Glow Wire Capable, Black, 43045-1600; Manufacturer: Molex; Circuits: 16; Rated Voltage: 600V; Rated Current: 8.5A; Automotive Qualified: False; Part Number: molex_microfit_3_08x2_THT; Part Name: MicroFit; Operating Temperature: -40°C - +105°C; Supplier 1: Farnell; Supplier Part Number 1: 9961380

## Nets that join several sheets
+3.0V_VREF2_0: primary_LTC (C205.2 IC201.34 TP204.1), connectors (C1501.2 C1506.2 X1501.17 X1508.1)
+3.0V_VREF2_1: secondary_LTC (C305.2 IC301.34 TP304.1), secon_analog_in (9 pins), connectors (C1502.2 C1507.2 X1502.17 X1508.2)
+5.0V_VREG_0: primary_LTC (10 pins), connectors (C1503.2 C1505.2 X1504.9 X1508.3)
+5.0V_VREG_1: secondary_LTC (10 pins), secon_analog_in (15 pins), secondary_DIO (13 pins), secondary_EEPROM_and_T (6 pins), connectors (C1504.2 C1508.2 X1505.9 X1508.4)
FUSED_VBAT+: primary_LTC (R201.1), secondary_LTC (R301.1), cell_fuses (F401.2)
FUSED_VBAT-: primary_LTC (14 pins), secondary_LTC (14 pins), cell_fuses (F415.2), primary_decoupling (12 pins), secondary_decoupling (12 pins), secon_analog_in (17 pins), secondary_DIO (C1200.1 C1201.1 U1200.2 U1200.8), secondary_EEPROM_and_T (5 pins), connectors (14 pins), bat_connectors (16 pins)
VBAT+: cell_fuses (F401.1 SJ401.1), bat_connectors (X1503.8)
VBAT-: cell_fuses (F415.1 SJ402.2), bat_connectors (X1503.1)

## Assembly variants
default: not fitted C507 C508 C509 C510 C511 C512 C519 C520 C521 C522 C523 C524 C607 C608 C609 C610 C611 C612 C619 C620 C621 C622 C623 C624 D1602 D1603 D1605 R209 R211 R213 R215 R217 R220 R309 R311 R313 R315 R317 R321 R1604 SJ401 SJ402 X1601
automotive: not fitted C507 C508 C509 C510 C511 C512 C519 C520 C521 C522 C523 C524 C607 C608 C609 C610 C611 C612 C619 C620 C621 C622 C623 C624 D1602 D1603 D1605 R209 R211 R213 R215 R217 R220 R309 R311 R313 R315 R317 R321 R1604 SJ401 SJ402 X1601; alternate parts U800 -> TLX9291A, U801 -> TLX9291A, U802 -> TLX9291A, U803 -> TLX9291A, U804 -> TLX9291A, U805 -> TLX9291A, U806 -> TLX9291A, U807 -> TLX9291A, U808 -> TLX9291A, U809 -> TLX9291A, U810 -> TLX9291A, U811 -> TLX9291A